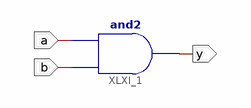
[diagram p0: schematic sheet 1]
// Xilinx ISE schematic sche1.sch (xc9500xl) as structural Verilog: 1 symbols, 3 ports
module sche1 (
  input  a,
  input  b,
  output y
);

  and XLXI_1 (y, b, a);
endmodule
